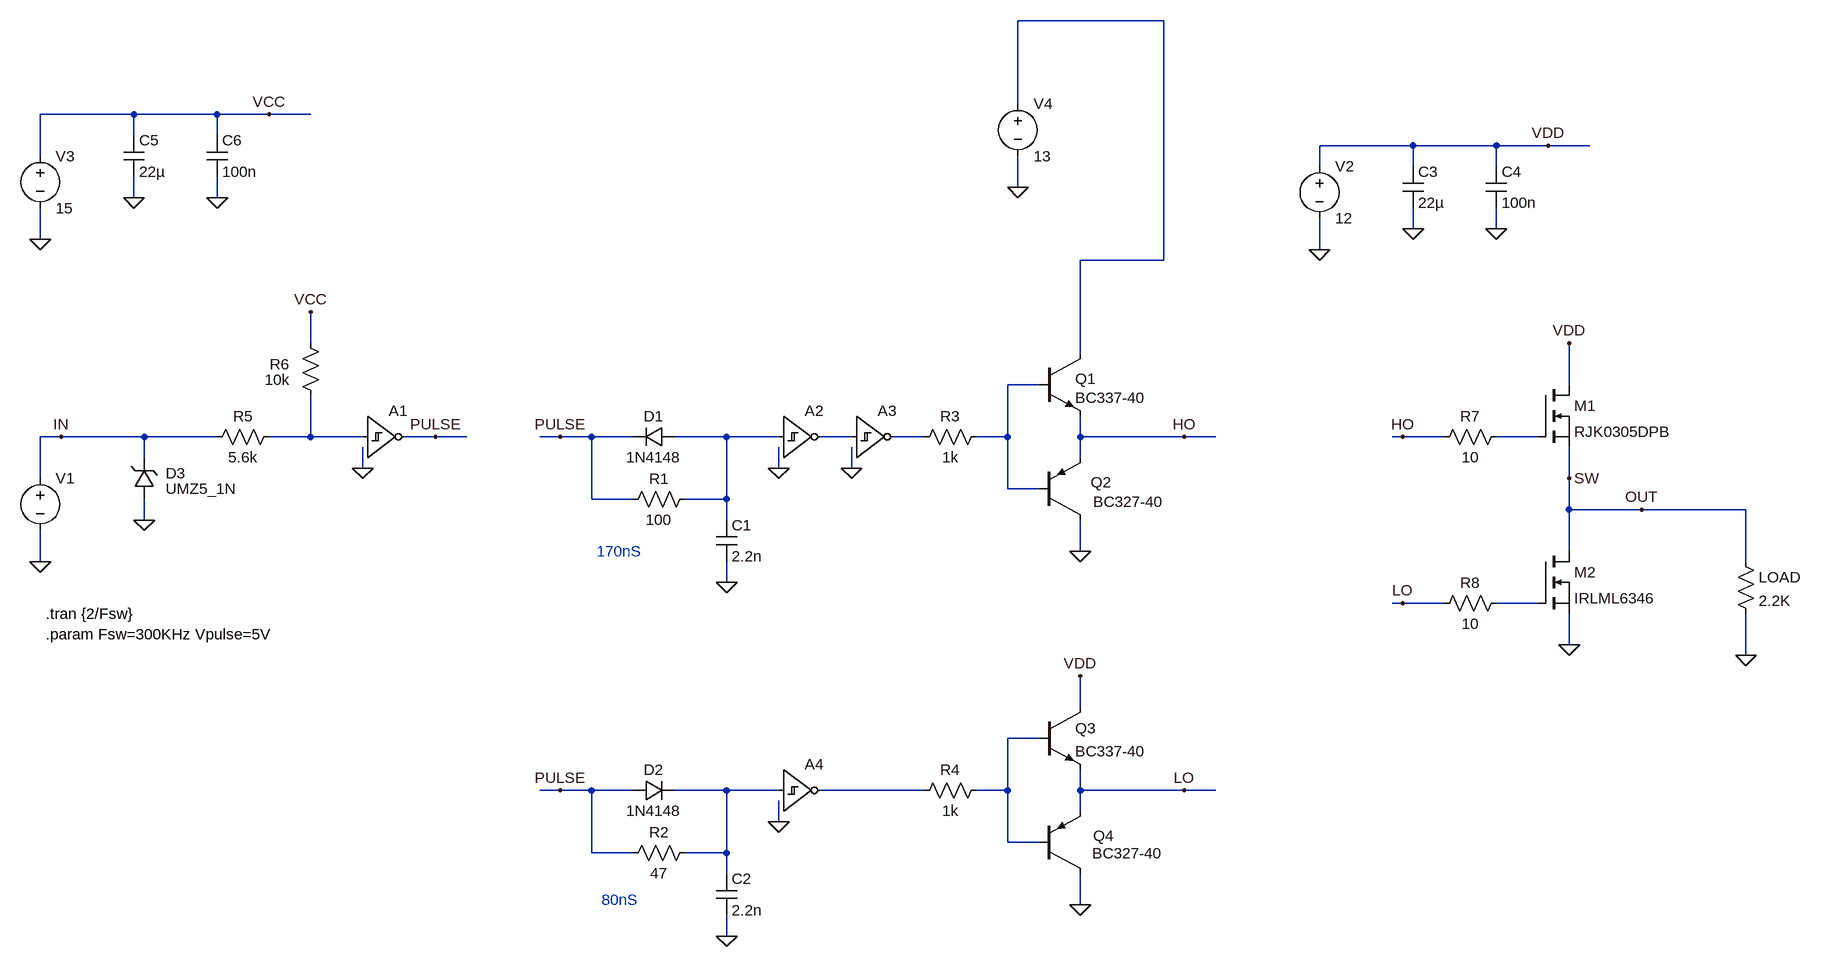
[diagram p0: schematic v1.0.asc]
v1.0.asc, the LTspice schematic file:
Version 4.1
SHEET 1 2676 788
WIRE 1184 -640 960 -640
WIRE 960 -512 960 -640
WIRE -400 -496 -544 -496
WIRE -272 -496 -400 -496
WIRE -192 -496 -272 -496
WIRE -128 -496 -192 -496
WIRE -400 -464 -400 -496
WIRE -272 -464 -272 -496
WIRE 1568 -448 1424 -448
WIRE 1696 -448 1568 -448
WIRE 1776 -448 1696 -448
WIRE 1840 -448 1776 -448
WIRE -544 -432 -544 -496
WIRE 1424 -416 1424 -448
WIRE 1568 -416 1568 -448
WIRE 1696 -416 1696 -448
WIRE 960 -384 960 -432
WIRE -400 -368 -400 -400
WIRE -272 -368 -272 -400
WIRE 1568 -320 1568 -352
WIRE 1696 -320 1696 -352
WIRE -544 -304 -544 -352
WIRE 1424 -288 1424 -336
WIRE 1184 -272 1184 -640
WIRE 1184 -272 1056 -272
WIRE -128 -144 -128 -192
WIRE 1056 -128 1056 -272
WIRE 992 -80 944 -80
WIRE 1808 -80 1808 -144
WIRE -512 0 -544 0
WIRE -384 0 -512 0
WIRE -272 0 -384 0
WIRE -128 0 -128 -64
WIRE -128 0 -192 0
WIRE -48 0 -128 0
WIRE 64 0 16 0
WIRE 112 0 64 0
WIRE 256 0 224 0
WIRE 304 0 256 0
WIRE 368 0 304 0
WIRE 512 0 432 0
WIRE 592 0 512 0
WIRE 704 0 656 0
WIRE 816 0 768 0
WIRE 944 0 944 -80
WIRE 944 0 896 0
WIRE 1056 0 1056 -32
WIRE 1216 0 1056 0
WIRE 1264 0 1216 0
WIRE 1552 0 1536 0
WIRE 1616 0 1552 0
WIRE 1760 0 1696 0
WIRE -384 32 -384 0
WIRE 1056 32 1056 0
WIRE -48 48 -48 16
WIRE 592 48 592 16
WIRE 704 48 704 16
WIRE -544 64 -544 0
WIRE 1808 64 1808 16
WIRE 944 80 944 0
WIRE 992 80 944 80
WIRE 304 96 304 0
WIRE 368 96 304 96
WIRE 512 96 512 0
WIRE 512 96 448 96
WIRE 1808 112 1808 64
WIRE 1920 112 1808 112
WIRE 2080 112 1920 112
WIRE -384 128 -384 96
WIRE 512 128 512 96
WIRE 1056 176 1056 128
WIRE 1808 176 1808 112
WIRE -544 192 -544 144
WIRE 2080 192 2080 112
WIRE 512 224 512 192
WIRE 1552 256 1536 256
WIRE 1616 256 1552 256
WIRE 1760 256 1696 256
WIRE 1808 320 1808 272
WIRE 2080 336 2080 272
WIRE 1056 416 1056 368
WIRE 992 464 944 464
WIRE 256 544 224 544
WIRE 304 544 256 544
WIRE 368 544 304 544
WIRE 512 544 432 544
WIRE 592 544 512 544
WIRE 816 544 656 544
WIRE 944 544 944 464
WIRE 944 544 896 544
WIRE 1056 544 1056 512
WIRE 1216 544 1056 544
WIRE 1264 544 1216 544
WIRE 1056 576 1056 544
WIRE 592 592 592 560
WIRE 944 624 944 544
WIRE 992 624 944 624
WIRE 304 640 304 544
WIRE 368 640 304 640
WIRE 512 640 512 544
WIRE 512 640 448 640
WIRE 512 672 512 640
WIRE 1056 720 1056 672
WIRE 512 768 512 736
FLAG -544 192 0
FLAG -512 0 IN
FLAG 592 48 0
FLAG 1216 0 HO
FLAG 512 224 0
FLAG 256 0 PULSE
FLAG 1216 544 LO
FLAG 512 768 0
FLAG 256 544 PULSE
FLAG 592 592 0
FLAG -48 48 0
FLAG 1424 -288 0
FLAG 1776 -448 VDD
FLAG 1056 176 0
FLAG 1568 -320 0
FLAG 1696 -320 0
FLAG 1056 368 VDD
FLAG 1056 720 0
FLAG -128 -192 VCC
FLAG -384 128 0
FLAG 64 0 PULSE
FLAG -544 -304 0
FLAG -192 -496 VCC
FLAG -400 -368 0
FLAG -272 -368 0
FLAG 704 48 0
FLAG 1808 -144 VDD
FLAG 1808 320 0
FLAG 1920 112 OUT
FLAG 1552 0 HO
FLAG 1552 256 LO
FLAG 1808 64 SW
FLAG 960 -384 0
FLAG 2080 336 0
SYMBOL voltage -544 48 R0
WINDOW 3 41 64 Invisible 2
WINDOW 123 0 0 Left 0
WINDOW 39 0 0 Left 0
SYMATTR Value PULSE(0 {Vpulse} 0 {0.01/Fsw} {0.01/Fsw} {0.5/Fsw} {1/Fsw})
SYMATTR InstName V1
SYMBOL diode 432 -16 R90
WINDOW 0 0 32 VBottom 2
WINDOW 3 32 32 VTop 2
SYMATTR InstName D1
SYMATTR Value 1N4148
SYMBOL res 464 80 R90
WINDOW 0 0 56 VBottom 2
WINDOW 3 32 56 VTop 2
SYMATTR InstName R1
SYMATTR Value 100
SYMBOL cap 496 128 R0
SYMATTR InstName C1
SYMATTR Value 2.2n
SYMBOL diode 368 560 R270
WINDOW 0 32 32 VTop 2
WINDOW 3 0 32 VBottom 2
SYMATTR InstName D2
SYMATTR Value 1N4148
SYMBOL res 464 624 R90
WINDOW 0 0 56 VBottom 2
WINDOW 3 32 56 VTop 2
SYMATTR InstName R2
SYMATTR Value 47
SYMBOL cap 496 672 R0
SYMATTR InstName C2
SYMATTR Value 2.2n
SYMBOL npn 992 -128 R0
WINDOW 0 56 39 Left 2
SYMATTR InstName Q1
SYMATTR Value BC337-40
SYMBOL pnp 992 128 M180
WINDOW 0 80 58 Left 2
WINDOW 3 84 28 Left 2
SYMATTR InstName Q2
SYMATTR Value BC327-40
SYMBOL res 912 -16 R90
WINDOW 0 0 56 VBottom 2
WINDOW 3 32 56 VTop 2
SYMATTR InstName R3
SYMATTR Value 1k
SYMBOL voltage 1424 -432 R0
WINDOW 123 0 0 Left 0
WINDOW 39 0 0 Left 0
SYMATTR InstName V2
SYMATTR Value 12
SYMBOL cap 1552 -416 R0
SYMATTR InstName C3
SYMATTR Value 22µ
SYMBOL cap 1680 -416 R0
SYMATTR InstName C4
SYMATTR Value 100n
SYMBOL npn 992 416 R0
SYMATTR InstName Q3
SYMATTR Value BC337-40
SYMBOL pnp 992 672 M180
WINDOW 0 84 58 Left 2
WINDOW 3 82 31 Left 2
SYMATTR InstName Q4
SYMATTR Value BC327-40
SYMBOL res 912 528 R90
WINDOW 0 0 56 VBottom 2
WINDOW 3 32 56 VTop 2
SYMATTR InstName R4
SYMATTR Value 1k
SYMBOL Digital\\schmtinv -48 -64 R0
WINDOW 3 8 104 Invisible 2
SYMATTR Value Vhigh=15
SYMATTR InstName A1
SYMBOL Digital\\schmtinv 592 -64 R0
WINDOW 3 8 104 Invisible 2
SYMATTR Value Vhigh=15
SYMATTR InstName A2
SYMBOL Digital\\schmtinv 704 -64 R0
WINDOW 3 8 104 Invisible 2
SYMATTR Value Vhigh=15
SYMATTR InstName A3
SYMBOL Digital\\schmtinv 592 480 R0
WINDOW 3 8 104 Invisible 2
SYMATTR Value Vhigh=15
SYMATTR InstName A4
SYMBOL res -176 -16 R90
WINDOW 0 0 56 VBottom 2
WINDOW 3 32 56 VTop 2
SYMATTR InstName R5
SYMATTR Value 5.6k
SYMBOL res -112 -48 R180
WINDOW 0 48 64 Left 2
WINDOW 3 48 40 Left 2
SYMATTR InstName R6
SYMATTR Value 10k
SYMBOL zener -400 96 M180
WINDOW 0 49 40 Left 2
WINDOW 3 49 16 Left 2
SYMATTR InstName D3
SYMATTR Value UMZ5_1N
SYMBOL voltage -544 -448 R0
WINDOW 123 0 0 Left 0
WINDOW 39 0 0 Left 0
SYMATTR InstName V3
SYMATTR Value 15
SYMBOL cap -416 -464 R0
SYMATTR InstName C5
SYMATTR Value 22µ
SYMBOL cap -288 -464 R0
SYMATTR InstName C6
SYMATTR Value 100n
SYMBOL nmos 1760 -80 R0
SYMATTR InstName M1
SYMATTR Value RJK0305DPB
SYMBOL nmos 1760 176 R0
SYMATTR InstName M2
SYMATTR Value IRLML6346
SYMBOL res 1600 16 R270
WINDOW 0 32 56 VTop 2
WINDOW 3 0 56 VBottom 2
SYMATTR InstName R7
SYMATTR Value 10
SYMBOL res 1600 272 R270
WINDOW 0 32 56 VTop 2
WINDOW 3 0 56 VBottom 2
SYMATTR InstName R8
SYMATTR Value 10
SYMBOL voltage 960 -528 R0
WINDOW 123 0 0 Left 0
WINDOW 39 0 0 Left 0
SYMATTR InstName V4
SYMATTR Value 13
SYMBOL res 2064 176 R0
SYMATTR InstName LOAD
SYMATTR Value 2.2K
TEXT -536 304 Left 2 !.param Fsw=300KHz Vpulse=5V
TEXT -536 272 Left 2 !.tran {2/Fsw}
TEXT 312 176 Left 2 ;170nS
TEXT 320 712 Left 2 ;80nS

The netlist it stands for:
* v1.0.asc
V1 IN 0 PULSE(0 {Vpulse} 0 {0.01/Fsw} {0.01/Fsw} {0.5/Fsw} {1/Fsw})
D1 N004 PULSE 1N4148
R1 N004 PULSE 100
C1 N004 0 2.2n
D2 PULSE N010 1N4148
R2 N010 PULSE 47
C2 N010 0 2.2n
Q1 N001 N002 HO 0 BC337-40
Q2 0 N002 HO 0 BC327-40
R3 N002 N006 1k
V2 VDD 0 12
C3 VDD 0 22µ
C4 VDD 0 100n
Q3 VDD N009 LO 0 BC337-40
Q4 0 N009 LO 0 BC327-40
R4 N009 N011 1k
A1 N003 0 0 0 0 PULSE 0 0 SCHMITT Vhigh=15
A2 N004 0 0 0 0 N005 0 0 SCHMITT Vhigh=15
A3 N005 0 0 0 0 N006 0 0 SCHMITT Vhigh=15
A4 N010 0 0 0 0 N011 0 0 SCHMITT Vhigh=15
R5 N003 IN 5.6k
R6 N003 VCC 10k
D3 0 IN UMZ5_1N
V3 VCC 0 15
C5 VCC 0 22µ
C6 VCC 0 100n
M1 VDD N007 SW SW RJK0305DPB
M2 SW N008 0 0 IRLML6346
R7 HO N007 10
R8 LO N008 10
V4 N001 0 13
R§LOAD SW 0 2.2K
.model D D
.lib standard.dio
.model NPN NPN
.model PNP PNP
.lib standard.bjt
.model NMOS NMOS
.model PMOS PMOS
.lib standard.mos
.param Fsw=300KHz Vpulse=5V
.tran {2/Fsw}
* 170nS
* 80nS
.backanno
.end